# Altium schematic sheet RADIO_nRF24L01.SchDoc
size A; SheetNumber: 5
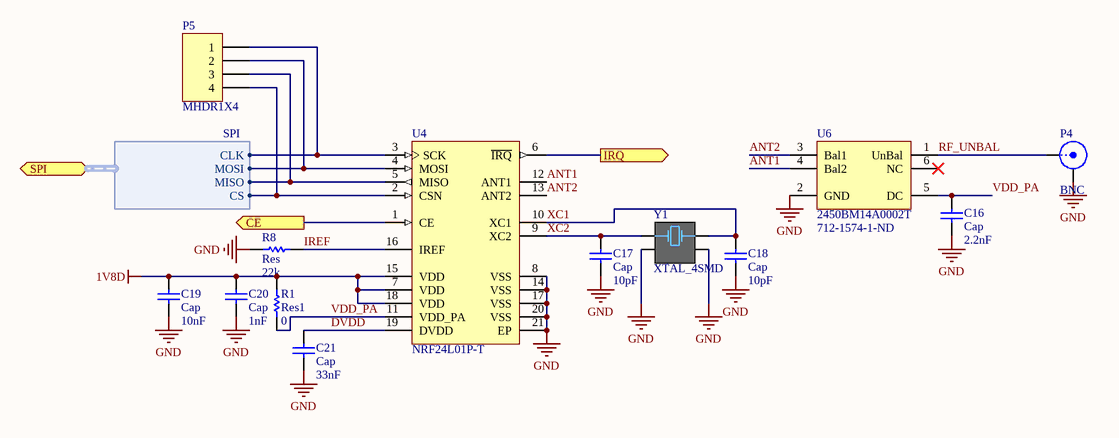
[diagram p0: RADIO_nRF24L01.SchDoc]

## Parts
C16  Cap  value 2.2nF  [CAPC1005N]
C17  Cap  value 10pF  [CAPC1005N]
C18  Cap  value 10pF  [CAPC1005N]
C19  Cap  value 10nF  [CAPC1005N]
C20  Cap  value 1nF  [CAPC1005N]
C21  Cap  value 33nF  [CAPC1005N]
P4  BNC  [MCB3-V4]
P5  MHDR1X4  [MHDR1X4]
R1  Res1  value 0  [RESC1005N]
R8  Res  value 22k  [RESC1005N]
U4  NRF24L01P-T  [NRSC-QFN-20_L]
U6  2450BM14A0002T  Supplier Part Number 1: 712-1574-1-ND  [2450BM14A0002]
Y1  XTAL_4SMD  [XTAL3225-4-N]

## Ports
CE (out), IRQ (out), SPI (bidir, harness SPI)

## Harnesses
SPI: MOSI, MISO, CS, CLK

## Nets
1V8D: C19.2 C20.2 R1.2 U4.7(VDD) U4.15(VDD) U4.18(VDD)
GND: C16.1 C17.1 C18.1 C19.1 C20.1 C21.1 P4.2(Y) R8.1 U4.8(VSS) U4.14(VSS) U4.17(VSS) U4.20(VSS) U4.21(EP) U6.2(GND) Y1.2 Y1.4
ANT1: U4.12(ANT1) U6.4(Bal2)
ANT2: U4.13(ANT2) U6.3(Bal1)
CE: U4.1(CE) ; port CE
DVDD: C21.2 U4.19(DVDD)
IREF: R8.2 U4.16(IREF)
IRQ: U4.6(~{IRQ}) ; port IRQ
RF_UNBAL: P4.1(X) U6.1(UnBal)
VDD_PA: C16.2 R1.1 U4.11(VDD_PA) U6.5(DC)
XC1: C18.2 U4.10(XC1) Y1.3(OSC2)
XC2: C17.2 U4.9(XC2) Y1.1(OSC1)
NetP5_1: P5.1 U4.3(SCK) ; port SPI.CLK
NetP5_2: P5.2 U4.4(MOSI) ; port SPI.MOSI
NetP5_3: P5.3 U4.5(MISO) ; port SPI.MISO
NetP5_4: P5.4 U4.2(CSN) ; port SPI.CS

Not connected (* = marked no-connect by the designer): U6 6(NC)*

## Library data of the parts
C16-C21 = Cap: Capacitor; Published: 8-Jun-2000; LatestRevisionDate: 17-Jul-2002; LatestRevisionNote: Re-released for DXP Platform.; PackageReference: RAD-0.3; Publisher: Altium Limited; PackageDescription: Radial Cap, Thru-Hole; 2 Leads; 0.3 in Pin Spacing
P4 = BNC: BNC Elbow Connector; LatestRevisionDate: 17-Jul-2002; LatestRevisionNote: Re-released for DXP Platform.; Publisher: Altium Limited
P5 = MHDR1X4: Header, 4-Pin; LatestRevisionDate: 17-Jul-2002; LatestRevisionNote: Re-released for DXP Platform.; Publisher: Altium Limited
R1 R8 = Res1: Resistor; Published: 8-Jun-2000; LatestRevisionDate: 17-Jul-2002; LatestRevisionNote: Re-released for DXP Platform.; PackageReference: AXIAL-0.3; Publisher: Altium Limited; PackageDescription: Axial Device, Thru-Hole; 2 Leads; 0.3 in Pin Spacing
U4 = CMP-2000-06859-1: Single Chip Transceiver, 2.4 GHz, 60 mW, 1.9 to 3.6 V, -40 to 85 degC, 20-Pin QFN, RoHS, Tray; Manufacturer: Nordic Semiconductor; Data Rate (Max): 2Mbps; Current - Transmitting: 7mA~11.3mA; Power - Output: 0dBm; Other Names: 1490-1019; Online Catalog: nRF24L01+; Current - Receiving: 12.6mA~13.5mA; For Use With: 1490-1002-ND-KITEVALUATIONNRF24L01P1568-1295-ND-SPARKFUNTRANSCEIVERBREAKOUT-1568-1296-ND-SPARKFUNTRANSCEIVERBREAKOUT-1471-1410-ND-DEVBOARDNRFSCLICKNRF24L01P-MODULE-PCB-ND-KITEVALNRF24L01+PCBANTENNANRF24L01P-MODULE-SMA-ND-KITEVALNRF24L01+SMACONNNRF24L01P-UPGRADE-ND-UPGRADE2PCB/1SMANRF24L01103990038-ND-DEVDUINOSENSORNODEV1.3103990053-ND-DEVDUINOSENSORNODEV2(ATMEGA103990074-ND-DEVDUINOSENSORNODE106990026-ND-ENERGYMONITORSHIELDV2113990088-ND-WIRELESSGATESHIELD113990095-ND-DEVDUINOSENSORNODEV3(ATMEGA106030001-ND-ENERGYMONITORSHIELD1597-1361-ND-DEVDUINOSENSORNODEV2.2(ATMEG105990030-ND-RGBWSTRIPWIRELESSSHIELDV1.0; Frequency: 2.4GHz; Design Resources: DevelopmentToolSelector; RF Family/Standard: GeneralISM>1GHZ; Serial Interfaces: SPI; Sensitivity: -94dBm; Voltage - Supply: 1.9V~3.6V; Modulation: GFSK; GPIO: -; Package Reference: QFN20; Memory Size: -; Category: RF/IFandRFID; Type: TxRxOnly; Standard Package: 490; Package / Case: 20-VFQFNExposedPad; Packaging: Tray; Series: -; Package Description: 20-Pin Quad Flat No-lead Package, Body 4 x 4 mm, Pitch 0.5 mm; Datasheet Version: Rev. 1.0, 09/2008; Protocol: -; Manufacturer URL: http://www.nordicsemi.com/eng/Products/; Operating Temperature: -40°C~85°C; Family: RFTransceiverICs; Datasheet URL: http://www.nordicsemi.com/eng/content/download/2726/34069/file/nRF24L01P_Product_Specification_1_0.pdf; Mounting Technology: SurfaceMount
U6 = 2450BM14A0002T: JOHANSON TECHNOLOGY - 2450BM14A0002T - BALUN, 2.45GHZ, IMPEDANCE MATCHED; Impedance: 50R; Insertion Loss: 2dB; Max Frequency: 2.5GHz; Return Loss: 9.5dB; Supplier 1: Digi-Key; Manufacturer 1: Johanson; Manufacturer Part Number 1: 2450BM14A0002T; Stock 1: 68815; Pricing 1: 1=0.94000, 10=0.83000, 25=0.74960, 100=0.65600, 250=0.57568, 500=0.50872, 1000=0.40163 (USD); RoHS: Yes; Mount: Surface Mount; Case/Package: 0603; Number of Pins: 6; Case Code (Metric): 1608; Case Code (Imperial): 0603; Contact Plating: Tin,Matte; Min Operating Temperature: -40°C; Max Operating Temperature: 85°C; Package Quantity: 4000; Packaging: Tape and Reel; Frequency: 2.45GHz; Termination: SMD/SMT; REACH SVHC: Unknown; ComponentLink1URL: https://datasheet.ciiva.com/7662/1644648-7662569.pdf?src-supplier=Element14; ComponentLink1Description: https://datasheet.ciiva.com/7662/1644648-7662569.pdf?src-supplier=Element14; ComponentLink2URL: https://datasheet.ciiva.com/29655/balun-filter-matched-2450bm14a0002-v2-29655610.pdf?src-supplier=Digi-Key; ComponentLink2Description: https://datasheet.ciiva.com/29655/balun-filter-matched-2450bm14a0002-v2-29655610.pdf?src-supplier=Digi-Key; ComponentLink3URL: https://datasheet.ciiva.com/24023/2450bm14a0002t-247800-24023183.pdf?src-supplier=Mouser; ComponentLink3Description: https://datasheet.ciiva.com/24023/2450bm14a0002t-247800-24023183.pdf?src-supplier=Mouser
Y1 = XTAL_4SMD: Crystal Oscillator (4 pin); Published: 8-Jun-2000; LatestRevisionDate: 17-Jul-2002; LatestRevisionNote: Re-released for DXP Platform.; PackageReference: R38; Publisher: Altium Limited; PackageDescription: Crystal, Thru-Hole; 2 Leads; Body 3.1 x 8.2 mm (Dia.xH)